# Altium schematic sheet Camera Module.SchDoc
size A; DocumentNumber: 5; SheetNumber: 7; SheetTotal: 9
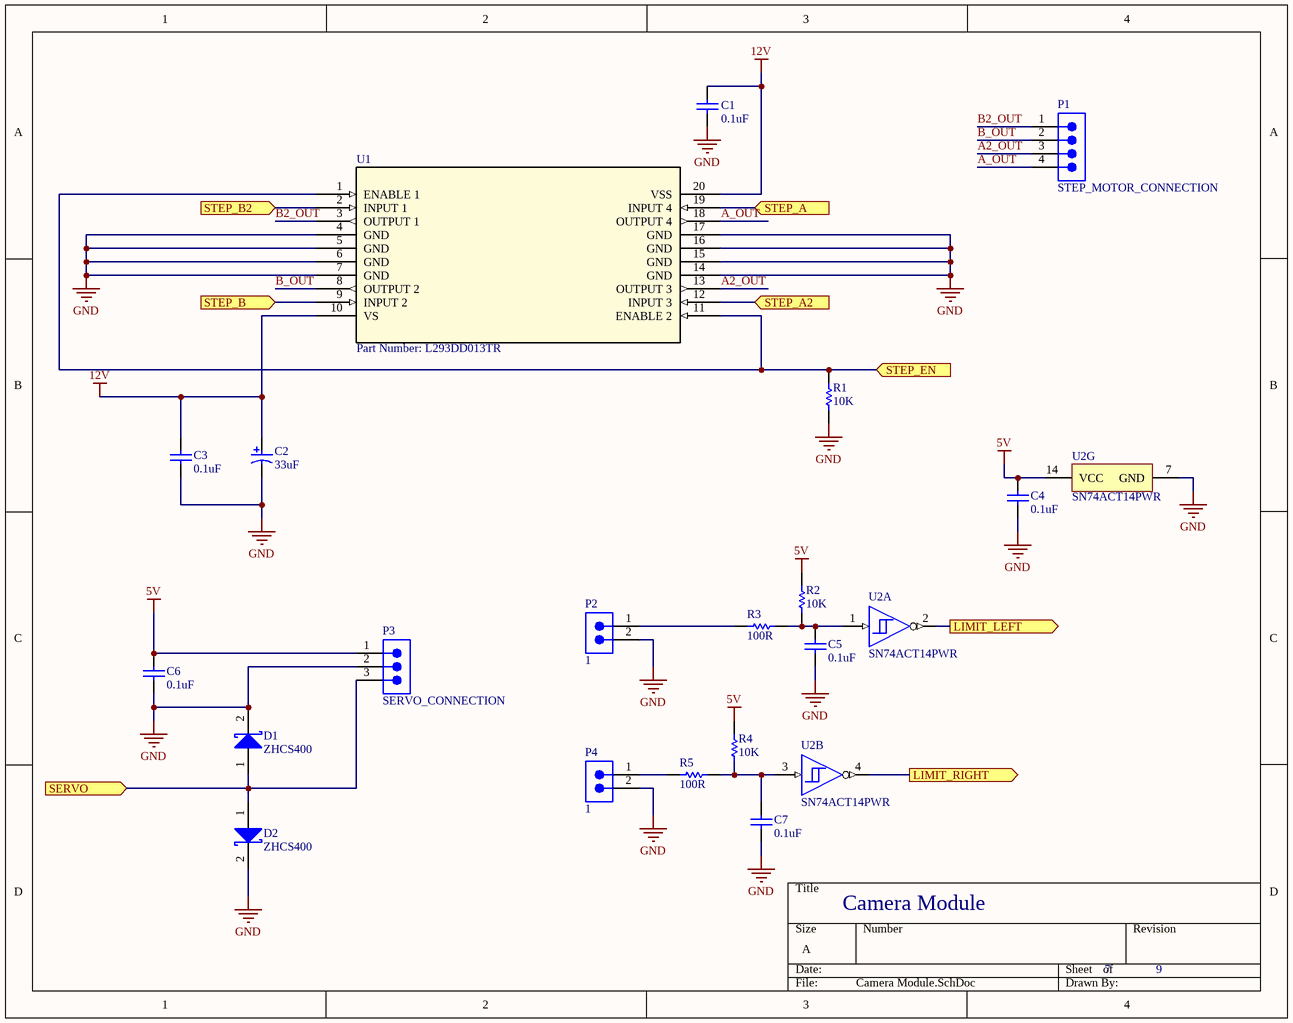
[diagram p0: Camera Module.SchDoc]

## Parts
C1  0.1uF  [CAPC1608X90X35LL15T15]
C2  33uF  [NIC-CAPA2-6.3X7.7_V]
C3  0.1uF  [CAPC1608X90X35LL15T15]
C4  0.1uF  [CAPC1608X90X35LL15T15]
C5  0.1uF  [CAPC1608X90X35LL15T15]
C6  0.1uF  [CAPC1608X90X35LL15T15]
C7  0.1uF  [CAPC1608X90X35LL15T15]
D1  ZHCS400  [DIOD-SOD323-2_V]
D2  ZHCS400  [DIOD-SOD323-2_V]
P1  STEP_MOTOR_CONNECTION  [SMTC-TSW-104-08-X-S]
P2  1  [SMTC-DW-02-16-X-S-200]
P3  SERVO_CONNECTION  [SMTC-TSW-103-07-X-S]
P4  1  [SMTC-DW-02-16-X-S-200]
R1  10K  [RESC1609X50X30ML10T20]
R2  10K  [RESC1609X50X30ML10T20]
R3  100R  [RESC1609X50X30ML10T20]
R4  10K  [RESC1609X50X30ML10T20]
R5  100R  [RESC1609X50X30ML10T20]
U1  Part Number: L293DD013TR  [SO-20]
U2  SN74ACT14PWR  [PW0014A_N]  (parts A,B,G of 7)

## Ports
LIMIT_LEFT (out), LIMIT_RIGHT (out), SERVO (in), STEP_A2 (in), STEP_A (in), STEP_B2 (in), STEP_B (in), STEP_EN (in)

## Nets
5V: C4.2 C6.2 P3.1(5V) R2.1 R4.1 U2.14(VCC)
12V: C1.2 C2.1 C3.2 U1.10(VS) U1.20(VSS)
GND: C1.1 C2.2 C3.1 C4.1 C5.1 C6.1 C7.1 D1.2(K) D2.2(K) P2.2 P3.2(Ground) P4.2 R1.1 U1.4(GND) U1.5(GND) U1.6(GND) U1.7(GND) U1.14(GND) U1.15(GND) U1.16(GND) U1.17(GND) U2.7(GND)
A2_OUT: P1.3 U1.13(OUTPUT_3)
A_OUT: P1.4 U1.18(OUTPUT_4)
B2_OUT: P1.1 U1.3(OUTPUT_1)
B_OUT: P1.2 U1.8(OUTPUT_2)
LIMIT_LEFT: U2.2(~{1Y}) ; port LIMIT_LEFT
LIMIT_RIGHT: U2.4(~{2Y}) ; port LIMIT_RIGHT
SERVO: D1.1(A) D2.1(A) P3.3(Signal) ; port SERVO
STEP_A: U1.19(INPUT_4) ; port STEP_A
STEP_A2: U1.12(INPUT_3) ; port STEP_A2
STEP_B: U1.9(INPUT_2) ; port STEP_B
STEP_B2: U1.2(INPUT_1) ; port STEP_B2
STEP_EN: R1.2 U1.1(ENABLE_1) U1.11(ENABLE_2) ; port STEP_EN
NetC5_2: C5.2 R2.2 R3.2 U2.1(1A)
NetC7_2: C7.2 R4.2 R5.2 U2.3(2A)
NetP2_1: P2.1 R3.1
NetP4_1: P4.1 R5.1

## Notes on the sheet
- Camera Module

## Library data of the parts
C1 C3-C7 = CMP-2006-04389-2: Chip Capacitor, 100 nF, +/- 10%, 50 V, -55 to 125 degC, 0603 (1608 Metric), RoHS, Tape and Reel; Case\Package: 0603; Type (Capacitors): X7R; Capacitance: 100 nF; Voltage Rating: 50 V; Pins: 2; Max Operating Temperature: 125 degC; Min Operating Temperature: -55 degC; Case Code (Imperial): 0603; DatasheetVersion: 07/2016; Package Quantity: 4000; Length: 1.6 mm; REACH SVHC: No SVHC; Packaging: Tape and Reel; Case Code (Metric): 1608; Mounting Technology: Surface Mount; RoHSCompliant: true; Height: 0.9 mm; ComponentLink1URL: http://www.avx.com/; ComponentLink2URL: http://datasheets.avx.com/X7RDielectric.pdf; Mount: Surface Mount; ComponentLink2Description: Datasheet; Width: 0.81 mm; PackageReference: 0603; PackageDescription: 2-Pin Surface Mount Device, Body 1.6 x 0.81 mm; Radiation Hardening: No; ComponentLink1Description: Manufacturer URL; Voltage Rating (DC): 50 V; Tolerance: 10%
C2 = CMP-0687-00057-1: Aluminum Electrolytic Capacitor, UD Series, Low Impedance, 33 uF, 50 V, + / - 20%, -55 to 105 degC, Chip Type, 6.3 x 7.7 mm D x L, Pb-Free, Reel; PartNumber: UUD1H330MCL1GS; Manufacturer: Nichicon; Endurance Time: 2000 h; Rated Voltage: 50 V; Rated Ripple Current (at 100kHz): 185 mA; Packing: Dia382mm Reel; Tolerance Rated Capacitance: -20 to 20%; Impedance: 0.68 Ohm; Mounting Technology: Surface Mount; DatasheetVersion: 08/2012; PackageReference: CAPAE-D6.3H7.7; ComponentLink1Description: Manufacturer URL; ComponentLink1URL: http://www.nichicon.co.jp/; Length: 7.7 mm; PackageDescription: 2-Pin Surface Mount Device, Diameter 6.3 mm, Height 7.7 mm, Pitch 5.4 mm; Diameter: 6.3 mm; Rated Capacitance: 33 uF; ComponentLink3Description: Package Specification; RoHS: TRUE; ComponentLink2Description: Datasheet; ComponentLink2URL: http://products.nichicon.co.jp/en/pdf/XJA043/e-ud.pdf; ComponentLink3URL: http://products.nichicon.co.jp/en/pdf/XJA043/e-ud.pdf
D1 D2 = CMP-0303-00001-1: Schottky Diode, 400mA; Manufacturer: Diodes Inc; Reverse Voltage: 40 V; Power Dissipation: 250 mW; Reverse Current: 40 uA@Vr=30 V; Packing Type: Tape and Reel; Forward Voltage: 425 mV@If=400 mA; PartNumber: ZHCS400; ComponentLink3URL: http://www.diodes.com/datasheets/ap02002.pdf; Moisture Sensitivity Level: 1; ComponentLink2URL: http://www.diodes.com/datasheets/ZHCS400.pdf; PackageDescription: 2-Pin SMT Diode, 1.7 x 1.3 mm Body; ComponentLink2Description: Datasheet; PackageReference: SOD323; ComponentLink1Description: Manufacturer URL; Mounting Technology: Surface Mount; DatasheetVersion: Rev. 8-2, 03/2012; ComponentLink1URL: http://www.diodes.com/; Storage Temperature: -55 to 150 degC; ComponentLink3Description: Package Specification; PackageVersion: Rev. 73
P1 = CMP-1024-00358-1: 0.025" SQ Post Header, Through-hole, Vertical, -55 to 125 degC, 2.54 mm Pitch, 4-Pin, Male, RoHS; PartNumber: TSW-104-08-L-S; Manufacturer: Samtec; Pitch: 2.54 mm; RoHS: True; Temperature Range: -55 to 125 degC; PackageDescription: .025[0.64] SQ. Post Terminal Strip Assembly; Orientation: Vertical; ComponentLink2URL: http://www.samtec.com/documents/webfiles/pdf/TSW_TH.PDF; ComponentLink1Description: Manufacturer URL; ComponentLink2Description: Datasheet; PackageVersion: DM, 8/1988; ComponentLink3URL: http://www.samtec.com/documents/webfiles/cpdf/TSW-XXX-XX-XXX-X-XX-XXX-MKT.pdf; Mounting Technology: Through-hole; PackageReference: TSW-104-08-X-S; ComponentLink3Description: Package Specification; ComponentLink1URL: http://www.samtec.com; DatasheetVersion: F-214
P2 P4 = CMP-1024-00001-1: Flexible .025" SQ Board Stacker, Through-hole, Vertical, -55 to 125 degC, 2.54 mm Pitch, 2-Pin, Male, RoHS; PartNumber: DW-02-16-G-S-200; Manufacturer: Samtec; Pitch: 2.54 mm; ComponentLink1Description: Manufacturer URL; ComponentLink3Description: Package Specification; DatasheetVersion: F-214; ComponentLink1URL: http://www.samtec.com; RoHS: True; PackageVersion: AX, 8/1984; ComponentLink2URL: http://www.samtec.com/documents/webfiles/pdf/DW.PDF; ComponentLink2Description: Datasheet; Orientation: Vertical; PackageReference: DW-02-16-X-S-200; PackageDescription: Low Cost Board Spacer; ComponentLink3URL: http://www.samtec.com/documents/webfiles/cpdf/XW-XX-XX-XXX-X-XXXX-XXX-XX-XXX-MKT1.PDF; Mounting Technology: Through-hole; Temperature Range: -55 to 125 degC
P3 = CMP-1024-00334-1: 0.025" SQ Post Header, Through-hole, Vertical, -55 to 125 degC, 2.54 mm Pitch, 3-Pin, Male, RoHS; Manufacturer: Samtec; PartNumber: TSW-103-07-L-S; Pitch: 2.54 mm; Mounting Technology: Through-hole; ComponentLink2URL: http://www.samtec.com/documents/webfiles/pdf/TSW_TH.PDF; ComponentLink3Description: Package Specification; PackageVersion: DM, 8/1988; PackageReference: TSW-103-07-X-S; Orientation: Vertical; ComponentLink1URL: http://www.samtec.com; PackageDescription: .025[0.64] SQ. Post Terminal Strip Assembly; ComponentLink1Description: Manufacturer URL; ComponentLink2Description: Datasheet; ComponentLink3URL: http://www.samtec.com/documents/webfiles/cpdf/TSW-XXX-XX-XXX-X-XX-XXX-MKT.pdf; RoHS: True; DatasheetVersion: F-214; Temperature Range: -55 to 125 degC
R1 R2 R4 = CMP-2000-03838-1: Manufacturer: Vishay Dale; Part Number: CRCW060310K0JNEA
R3 R5 = CMP-2000-03827-1: Part Number: CRCW0603100RJNEA; Manufacturer: Vishay Dale
U1 = L293DD013TR: No Description Available; Vendor: STMicroelectronics; Built_By: EMA_UL_Team; Manufacturer_Part_Number: L293DD013TR; Copyright: Copyright (C) 2018 Accelerated Designs. All rights reserved; RefDes: RefDes; Type: DEV; Value: Value
U2 = CMP-0268-00001-5: Hex Schmitt-Trigger Inverters, PW0014A, LARGE T&R; Manufacturer: Texas Instruments; Voltage(Nom)(V): 5; F @ Nom Voltage(Max)(Mhz): 90; Input Type: TTL; tpd @ Nom Voltage(Max)(ns): 12.5; Output Type: CMOS; Bits(#): 6; VCC(Max)(V): 5.5; Technology Family: ACT; Output Drive (IOL/IOH)(Max)(mA): -24/24; ICC @ Nom Voltage(Max)(mA): 0.02; Schmitt Trigger: Yes; VCC(Min)(V): 4.5; Rating: Catalog; Code_JEDEC: MO-153; PackageReference: PW0014A; Operating Temperature Range(C): -40 to 85; Generic Part Number: SN74ACT14; DatasheetVersion: SCAS557H